# EAGLE design led_module (EAGLE 9.3.2)
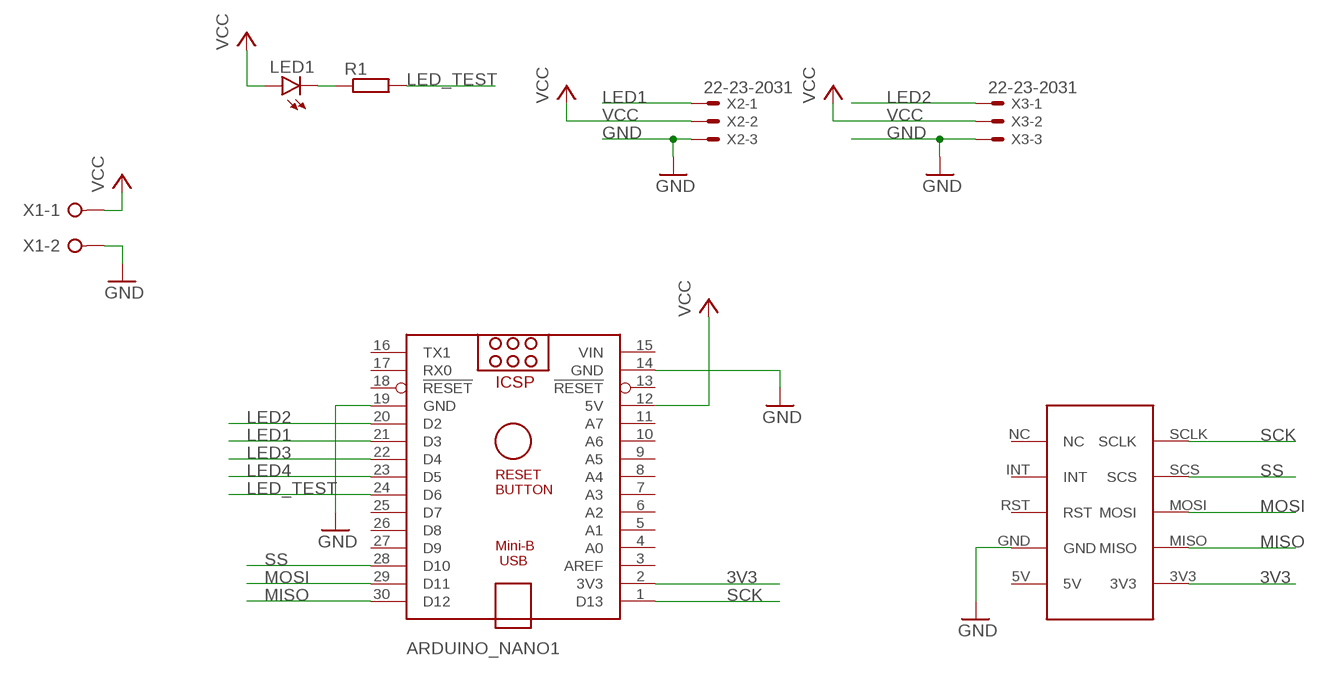
[diagram p0: schematic, sheet 1]

## Parts
ARDUINO_NANO1  ARDUINO_NANO  [ARDUINO_NANO]
LED1  LEDSML1206  [SML1206]
R1  R-EU_M1206  [M1206]
U$1  W5500_MODULE  [W5500_MODULE]
X1  W237-02P  [W237-132]
X2  22-23-2031  [22-23-2031]
X3  22-23-2031  [22-23-2031]

## Nets
3V3: ARDUINO_NANO1.2(3V3) U$1.3V3
GND: ARDUINO_NANO1.14(GND) ARDUINO_NANO1.19(GND) U$1.GND X1.2 X2.3 X3.3
LED1: ARDUINO_NANO1.21(D3) X2.1
LED2: ARDUINO_NANO1.20(D2) X3.1
LED3: ARDUINO_NANO1.22(D4)
LED4: ARDUINO_NANO1.23(D5)
LED_TEST: ARDUINO_NANO1.24(D6) R1.2
MISO: ARDUINO_NANO1.30(D12) U$1.MISO
MOSI: ARDUINO_NANO1.29(D11) U$1.MOSI
N$2: LED1.C R1.1
SCK: ARDUINO_NANO1.1(D13) U$1.SCLK
SS: ARDUINO_NANO1.28(D10) U$1.SCS
VCC: ARDUINO_NANO1.12(5V) LED1.A X1.1 X2.2 X3.2
Unconnected: ARDUINO_NANO1.3(AREF) ARDUINO_NANO1.4(A0) ARDUINO_NANO1.5(A1) ARDUINO_NANO1.6(A2) ARDUINO_NANO1.7(A3) ARDUINO_NANO1.8(A4) ARDUINO_NANO1.9(A5) ARDUINO_NANO1.10(A6) ARDUINO_NANO1.11(A7) ARDUINO_NANO1.13(!RESET) ARDUINO_NANO1.16(TX1) ARDUINO_NANO1.17(RX0) ARDUINO_NANO1.18(!RESET) ARDUINO_NANO1.25(D7) ARDUINO_NANO1.26(D8) ARDUINO_NANO1.27(D9) U$1.5V U$1.INT U$1.NC U$1.RST

## Power pins joined to a net without a drawn wire
VIN: ARDUINO_NANO1.15(VIN)

## Library data of the parts
ARDUINO_NANO1 = ArduinoNanoV30:ARDUINO_NANO: Arduino Nano V3.0 Overview: The Arduino Nano is a small, complete, and breadboard-friendly board based on the ATmega328 (Arduino Nano 3.x) or ATmega168 (Arduino Nano 2.x). It has more or less the same functionality of the Arduino Duemilanove, but in a different package. It lacks only a DC power jack, and works with a Mini-B USB cable instead of a standard one. The Nano was designed and is being produced by Gravitech. Specifications: Microcontroller Atmel ATmega168 or ATmega328 Operating Voltage (logic level) 5 V Input Voltage (recommended) 7-12 V Input Voltage (limits) 6-20 V Digital I/O Pins 14 (of which 6 provide PWM output) Analog Input Pins 8 DC Current per I/O Pin 40 mA Flash Memory 16 KB (ATmega168) or 32 KB (ATmega328) of which 2 KB used by bootloader SRAM 1 KB (ATmega168) or 2 KB (ATmega328) EEPROM 512 bytes (ATmega168) or 1 KB (ATmega328) Clock Speed 16 MHz Dimensions 0.73" x 1.70" Length 45 mm Width 18 mm Weigth 5 g Power: The Arduino Nano can be powered via the Mini-B USB connection, 6-20V unregulated external power supply (pin 30), or 5V regulated external power supply (pin 27). The power source is automatically selected to the highest voltage source. Memory: The ATmega168 has 16 KB of flash memory for storing code (of which 2 KB is used for the bootloader); the ATmega328 has 32 KB, (also with 2 KB used for the bootloader). The ATmega168 has 1 KB of SRAM and 512 bytes of EEPROM (which can be read and written with the EEPROM library); the ATmega328 has 2 KB of SRAM and 1 KB of EEPROM. Input and Output: Each of the 14 digital pins on the Nano can be used as an input or output, using pinMode(), digitalWrite(), and digitalRead() functions. They operate at 5 volts. Each pin can provide or receive a maximum of 40 mA and has an internal pull-up resistor (disconnected by default) of 20-50 kOhms. In addition, some pins have specialized functions. Visit Arduino - ArduinoBoardNano <https://www.arduino.cc/en/Main/ArduinoBoardNano>
LED1 = led:LED: LED OSRAM: - CHIPLED LG R971, LG N971, LY N971, LG Q971, LY Q971, LO R971, LY R971 LH N974, LH R974 LS Q976, LO Q976, LY Q976 LO Q996 - Hyper CHIPLED LW Q18S LB Q993, LB Q99A, LB R99A - SideLED LS A670, LO A670, LY A670, LG A670, LP A670 LB A673, LV A673, LT A673, LW A673 LH A674 LY A675 LS A676, LA A676, LO A676, LY A676, LW A676 LS A679, LY A679, LG A679 - Hyper Micro SIDELED® LS Y876, LA Y876, LO Y876, LY Y876 LT Y87S - SmartLED LW L88C, LW L88S LB L89C, LB L89S, LG L890 LS L89K, LO L89K, LY L89K LS L896, LA L896, LO L896, LY L896 - TOPLED LS T670, LO T670, LY T670, LG T670, LP T670 LSG T670, LSP T670, LSY T670, LOP T670, LYG T670 LG T671, LOG T671, LSG T671 LB T673, LV T673, LT T673, LW T673 LH T674 LS T676, LA T676, LO T676, LY T676, LB T676, LH T676, LSB T676, LW T676 LB T67C, LV T67C, LT T67C, LS T67K, LO T67K, LY T67K, LW E67C LS E67B, LA E67B, LO E67B, LY E67B, LB E67C, LV E67C, LT E67C LW T67C LS T679, LY T679, LG T679 LS T770, LO T770, LY T770, LG T770, LP T770 LB T773, LV T773, LT T773, LW T773 LH T774 LS E675, LA E675, LY E675, LS T675 LS T776, LA T776, LO T776, LY T776, LB T776 LHGB T686 LT T68C, LB T68C - Hyper Mini TOPLED® LB M676 - Mini TOPLED Santana® LG M470 LS M47K, LO M47K, LY M47K Source: http://www.osram.convergy.de LUXEON: - LUMILED® LXK2-PW12-R00, LXK2-PW12-S00, LXK2-PW14-U00, LXK2-PW14-V00 LXK2-PM12-R00, LXK2-PM12-S00, LXK2-PM14-U00 LXK2-PE12-Q00, LXK2-PE12-R00, LXK2-PE12-S00, LXK2-PE14-T00, LXK2-PE14-U00 LXK2-PB12-K00, LXK2-PB12-L00, LXK2-PB12-M00, LXK2-PB14-N00, LXK2-PB14-P00, LXK2-PB14-Q00 LXK2-PR12-L00, LXK2-PR12-M00, LXK2-PR14-Q00, LXK2-PR14-R00 LXK2-PD12-Q00, LXK2-PD12-R00, LXK2-PD12-S00 LXK2-PH12-R00, LXK2-PH12-S00 LXK2-PL12-P00, LXK2-PL12-Q00, LXK2-PL12-R00 Source: www.luxeon.com KINGBRIGHT: KA-3528ASYC Source: www.kingbright.com
R1 = rcl:R-EU_: RESISTOR, European symbol; SPICEPREFIX: R
U$1 = ligocki:W5500_MODULE
X1 = con-wago-508:W237-02P: WAGO SREW CLAMP; OC_FARNELL: unknown; OC_NEWARK: unknown
X2 X3 = con-molex:22-23-2031: .100" (2.54mm) Center Header - 3 Pin; MF: MOLEX; MPN: 22-23-2031; OC_FARNELL: 1462950; OC_NEWARK: 30C0862

## Board
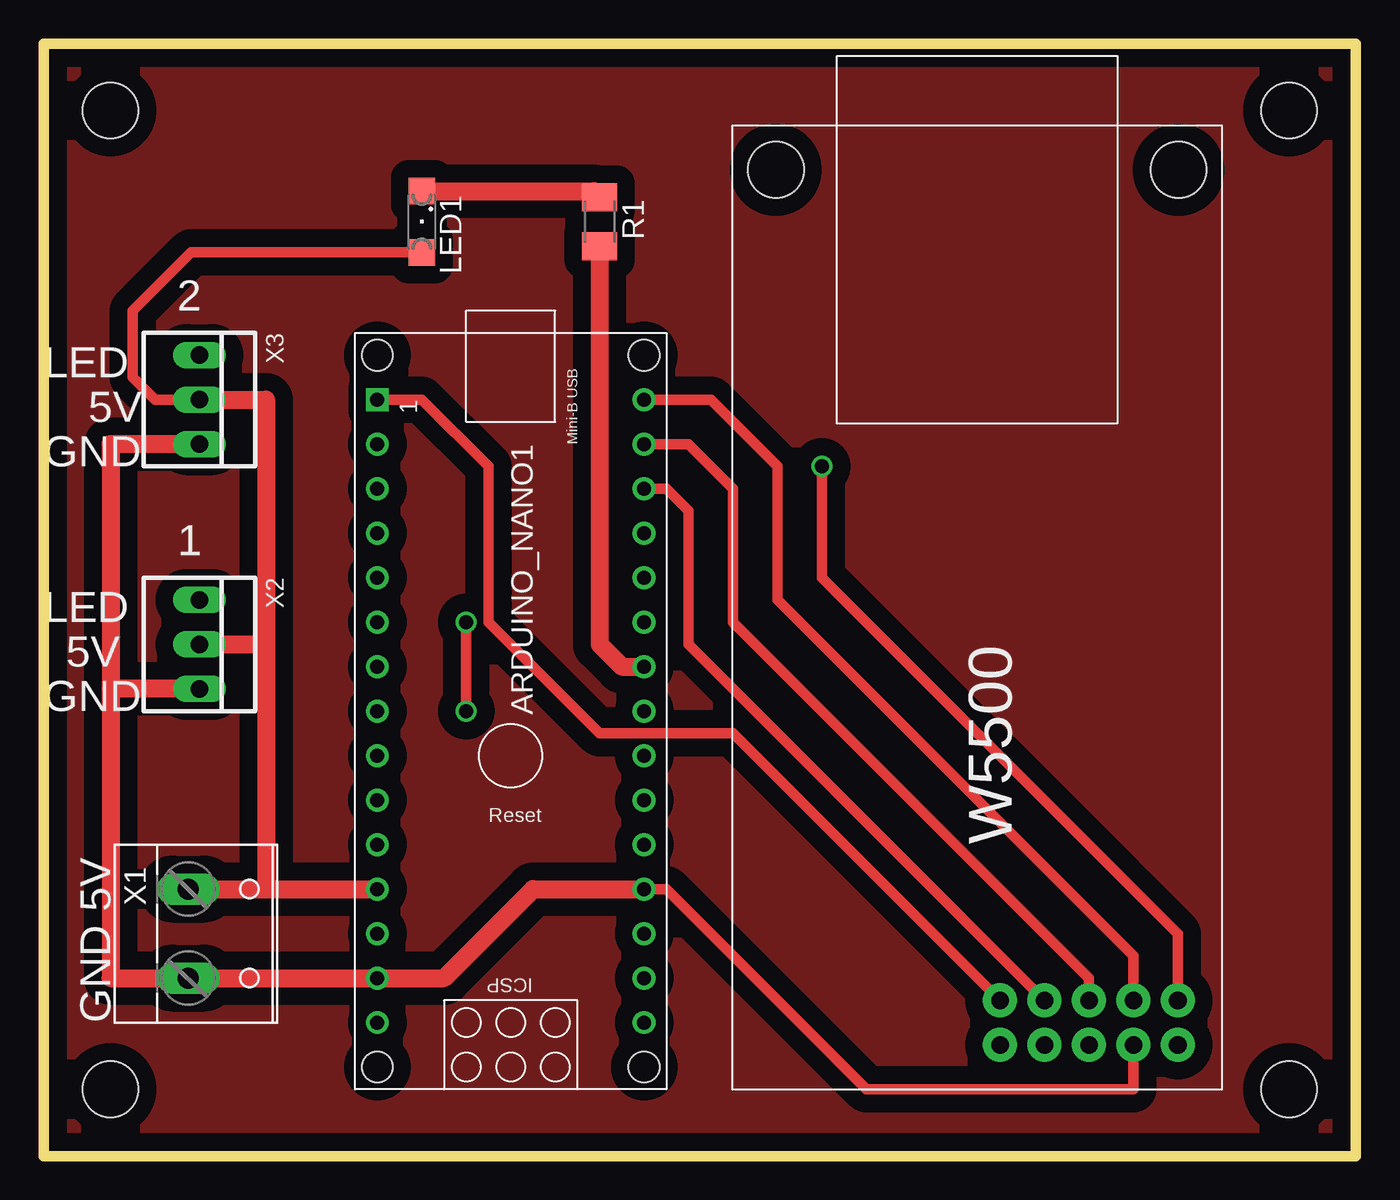
[diagram p1: board, top side]
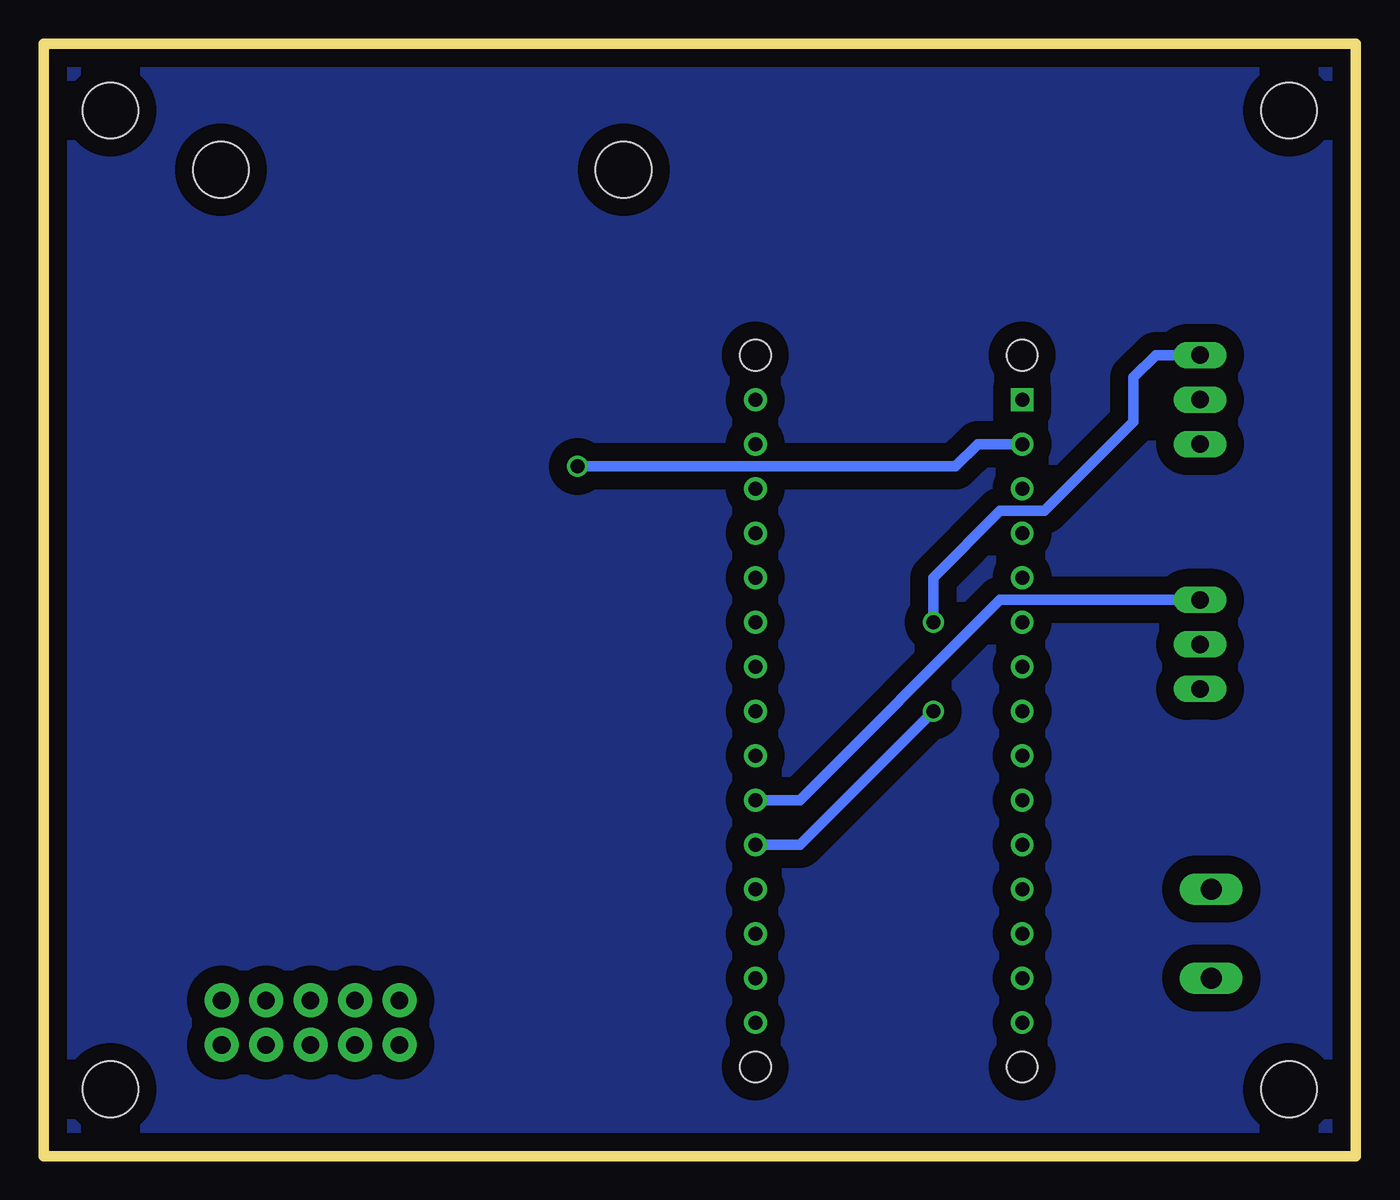
[diagram p2: board, bottom side, seen from below]

Size 74.93 x 63.5 mm. Coordinates in mm from the lower left corner, seen from the top.
Outline: 0,0 74.93,0 74.93,63.5 0,63.5 0,0
Copper layers (1*16): Top 0.035mm / dielectric 1.5mm / Bottom 0.035mm
Design rules "default": minimum track width 6mil, minimum drill 0.35mm, track to track 6mil, track to pad 6mil, pad to pad 6mil, via to via 6mil, smd to smd 6mil, copper to edge 40mil, drill to drill 6mil, minimum pad ring 10mil, minimum via ring 8mil, stop-mask expansion 4mil, vias tented up to drill 0mil, thermal gap 10mil
Holes 3.2 mm at 3.81,59.69 3.81,3.81 71.12,3.81 71.12,59.69

### Footprints (pad centres in the part's own frame; a part is rotated, then mirrored left to right if it is on the bottom)
ARDUINO_NANO = drill 0.8 square: 1 -20.32,-7.62 | drill 0.8: 2 -17.78,-7.62; 3 -15.24,-7.62; 4 -12.7,-7.62; 5 -10.16,-7.62; 6 -7.62,-7.62; 7 -5.08,-7.62; 8 -2.54,-7.62; 9 0,-7.62; 10 2.54,-7.62; 11 5.08,-7.62; 12 7.62,-7.62; 13 10.16,-7.62; 14 12.7,-7.62; 15 15.24,-7.62; 16 15.24,7.62; 17 12.7,7.62; 18 10.16,7.62; 19 7.62,7.62; 20 5.08,7.62; 21 2.54,7.62; 22 0,7.62; 23 -2.54,7.62; 24 -5.08,7.62; 25 -7.62,7.62; 26 -10.16,7.62; 27 -12.7,7.62; 28 -15.24,7.62; 29 -17.78,7.62; 30 -20.32,7.62 | hole 1.778: -22.86,-7.62; -22.86,7.62; 17.78,7.62; 17.78,-7.62
SML1206 = smd 1.5 x 1.5: A 1.75,0; C -1.75,0
M1206 = smd 1.6 x 2: 1 -1.4,0; 2 1.4,0
W5500_MODULE = drill 1 pad 1.93: 3V3 5.08,2.54; 5V 2.54,2.54; GND 2.54,5.08; INT 2.54,10.16; MISO 5.08,5.08; MOSI 5.08,7.62; NC 2.54,12.7; RST 2.54,7.62; SCLK 5.08,12.7; SCS 5.08,10.16 | hole 3.2: 52.5,25.5; 52.5,2.5
W237-132 = drill 1.194 long: 1 -2.54,-0.635; 2 2.54,-0.635
22-23-2031 = drill 1 long: 1 -2.54,0; 2 0,0; 3 2.54,0

### Placement (x,y rotation side)
ARDUINO_NANO1  26.67,22.86 270 top
LED1  21.59,53.34 270 top
R1  31.75,53.34 270 top
U$1  67.31,3.81 90 top
X1  8.89,12.7 270 top
X2  8.89,29.21 270 top
X3  8.89,43.18 270 top

### Tracks (layer width: path | path; a pad name or v marks a point on that pad's centre or on a via)
3V3  (via drill 0.8)
  Top 0.61: v44.45,39.37 44.45,33.02 64.77,12.7 U$1.3V3
  Bottom 0.61: v44.45,39.37 22.86,39.37 21.59,40.64 ARDUINO_NANO1.2
GND
  Top 0.61: U$1.GND 62.23,3.81 46.99,3.81 35.56,15.24 ARDUINO_NANO1.19
  Top 1.016: ARDUINO_NANO1.19 27.94,15.24 22.86,10.16 ARDUINO_NANO1.14 X1.2 3.81,10.16 3.81,26.67 | X2.3 3.81,26.67 | X3.3 3.81,40.64 3.81,26.67
LED1
  Bottom 0.61: X2.1 20.32,31.75 31.75,20.32 ARDUINO_NANO1.21
LED2  (via drill 0.8)
  Top 0.61: v24.13,25.4 v24.13,30.48
  Bottom 0.61: ARDUINO_NANO1.20 31.75,17.78 v24.13,25.4 | v24.13,30.48 24.13,33.02 20.32,36.83 17.78,36.83 12.7,41.91 12.7,44.45 11.43,45.72 X3.1
LED_TEST
  Top 1.016: R1.2 31.75,29.21 33.02,27.94 ARDUINO_NANO1.24
MISO
  Top 0.61: U$1.MISO 62.23,11.43 41.91,31.75 41.91,39.37 38.1,43.18 ARDUINO_NANO1.30
MOSI
  Top 0.61: ARDUINO_NANO1.29 36.83,40.64 39.37,38.1 39.37,30.48 59.69,10.16 U$1.MOSI
N$1
  pour Top (isolate 1.016): 0,0 74.93,0 74.93,63.5 0,63.5
N$2
  Top 1.016: LED1.C 31.4,55.09 R1.1
N$3
  pour Bottom (isolate 1.016): 0,63.5 74.93,63.5 74.93,0 0,0
SCK
  Top 0.61: U$1.SCLK 39.37,24.13 31.75,24.13 25.4,30.48 25.4,39.37 21.59,43.18 ARDUINO_NANO1.1
SS
  Top 0.61: U$1.SCS 36.83,29.21 36.83,36.83 35.56,38.1 ARDUINO_NANO1.28
VCC
  Top 0.61: LED1.A 8.41,51.59 5.08,48.26 5.08,44.45 6.35,43.18 X3.2
  Top 1.016: X1.1 12.7,15.24 | 12.7,15.24 ARDUINO_NANO1.12 | X3.2 12.7,43.18 12.7,29.21 | 12.7,29.21 12.7,15.24 | X2.2 12.7,29.21

### Text on the board
tPlace: 2 | LED | 5V | GND | 1 | LED | 5V | GND | 5V | GND